# Altium schematic sheet LAN8720.SchDoc
size A
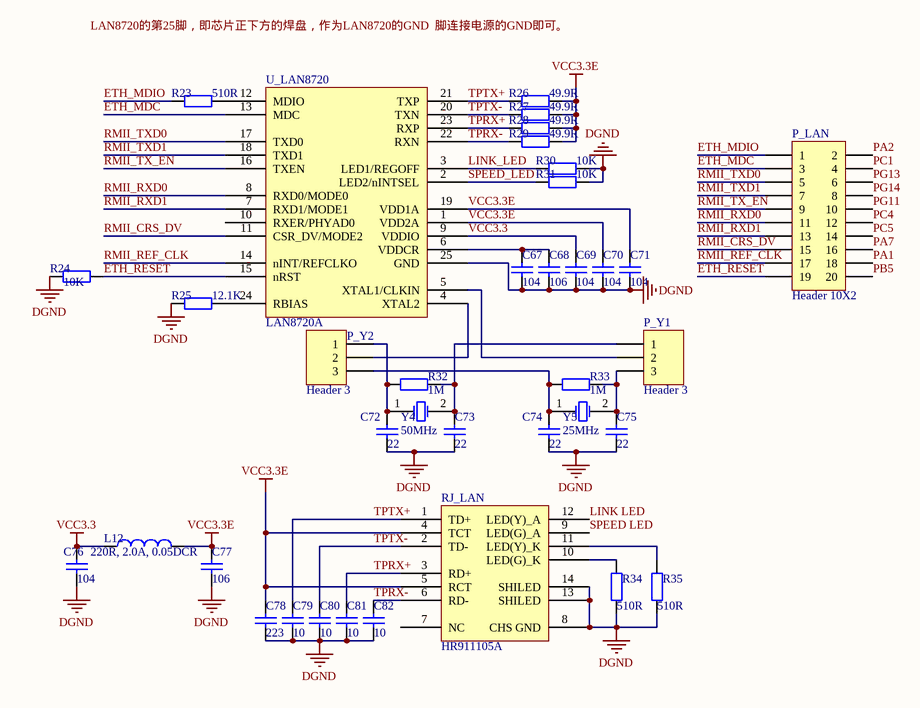
[diagram p0: LAN8720.SchDoc]

## Parts
C67  value 104  [SMT-0603]  (hidden comment: Cap)
C68  value 106  [SMT-0603]  (hidden comment: Cap)
C69  value 104  [SMT-0603]  (hidden comment: Cap)
C70  value 104  [SMT-0603]  (hidden comment: Cap)
C71  value 104  [SMT-0603]  (hidden comment: Cap)
C72  value 22  [SMT-0603]  (hidden comment: Cap)
C73  value 22  [SMT-0603]  (hidden comment: Cap)
C74  value 22  [SMT-0603]  (hidden comment: Cap)
C75  value 22  [SMT-0603]  (hidden comment: Cap)
C76  value 104  [SMT-0603]  (hidden comment: Cap)
C77  value 106  [SMT-0603]  (hidden comment: Cap)
C78  value 223  [SMT-0603]  (hidden comment: Cap)
C79  value 10  [SMT-0603]  (hidden comment: Cap)
C80  value 10  [SMT-0603]  (hidden comment: Cap)
C81  value 10  [SMT-0603]  (hidden comment: Cap)
C82  value 10  [SMT-0603]  (hidden comment: Cap)
L12  value 220R, 2.0A, 0.05DCR  [SMT-0603]  (hidden comment: Inductor)
P_LAN  Header 10X2  [HDR2X10]
P_Y1  Header 3  [HDR1X3]
P_Y2  Header 3  [HDR1X3]
R23  value 510R  [SMT-0603]  (hidden comment: Res2)
R24  value 10K  [SMT-0603]  (hidden comment: Res2)
R25  value 12.1K  [SMT-0603]  (hidden comment: Res2)
R26  value 49.9R  [SMT-0603]  (hidden comment: Res2)
R27  value 49.9R  [SMT-0603]  (hidden comment: Res2)
R28  value 49.9R  [SMT-0603]  (hidden comment: Res2)
R29  value 49.9R  [SMT-0603]  (hidden comment: Res2)
R30  value 10K  [SMT-0603]  (hidden comment: Res2)
R31  value 10K  [SMT-0603]  (hidden comment: Res2)
R32  value 1M  [SMT-0603]  (hidden comment: Res2)
R33  value 1M  [SMT-0603]  (hidden comment: Res2)
R34  value 510R  [SMT-0603]  (hidden comment: Res2)
R35  value 510R  [SMT-0603]  (hidden comment: Res2)
RJ_LAN  HR911105A  [RJ45-LED]
U_LAN8720  LAN8720A  [QFN24_0.5]
Y4  50MHz  [D-CRYSTAL3X8]
Y5  25MHz  [D-CRYSTAL3X8]

## Nets
DGND: C67.1 C68.1 C69.1 C70.1 C71.1 C72.1 C73.1 C74.1 C75.1 C76.1 C77.1 C78.1 C79.1 C80.1 C81.1 C82.1 R24.1 R25.1 R30.2 R31.2 R34.1 R35.1 RJ_LAN.8(CHS_GND) RJ_LAN.13(SHILED) RJ_LAN.14(SHILED) U_LAN8720.25(GND)
VCC3.3: C69.2 C76.2 L12.1 U_LAN8720.9(VDDIO)
VCC3.3E: C70.2 C71.2 C77.2 C78.2 L12.2 R26.2 R27.2 R28.2 R29.2 RJ_LAN.4(TCT) RJ_LAN.5(RCT) U_LAN8720.1(VDD2A) U_LAN8720.19(VDD1A)
ETH_MDC: P_LAN.3 U_LAN8720.13(MDC)
ETH_MDIO: P_LAN.1 R23.1
ETH_RESET: P_LAN.19 R24.2 U_LAN8720.15(nRST)
LINK LED: RJ_LAN.12(LED(Y)_A)
LINK_LED: R30.1 U_LAN8720.3(LED1/REGOFF)
PA1: P_LAN.18
PA2: P_LAN.2
PA7: P_LAN.16
PB5: P_LAN.20
PC1: P_LAN.4
PC4: P_LAN.12
PC5: P_LAN.14
PG11: P_LAN.10
PG13: P_LAN.6
PG14: P_LAN.8
RMII_CRS_DV: P_LAN.15 U_LAN8720.11(CSR_DV/MODE2)
RMII_REF_CLK: P_LAN.17 U_LAN8720.14(nINT/REFCLKO)
RMII_RXD0: P_LAN.11 U_LAN8720.8(RXD0/MODE0)
RMII_RXD1: P_LAN.13 U_LAN8720.7(RXD1/MODE1)
RMII_TX_EN: P_LAN.9 U_LAN8720.16(TXEN)
RMII_TXD0: P_LAN.5 U_LAN8720.17(TXD0)
RMII_TXD1: P_LAN.7 U_LAN8720.18(TXD1)
SPEED LED: RJ_LAN.9(LED(G)_A)
SPEED_LED: R31.1 U_LAN8720.2(LED2/nINTSEL)
TPRX+: C81.2 R28.1 RJ_LAN.3(RD+) U_LAN8720.23(RXP)
TPRX-: C82.2 R29.1 RJ_LAN.6(RD-) U_LAN8720.22(RXN)
TPTX+: C79.2 R26.1 RJ_LAN.1(TD+) U_LAN8720.21(TXP)
TPTX-: C80.2 R27.1 RJ_LAN.2(TD-) U_LAN8720.20(TXN)
NetC67_2: C67.2 C68.2 U_LAN8720.6(VDDCR)
NetC72_2: C72.2 P_Y2.1 R32.1 Y4.1(OSC1)
NetC73_2: C73.2 P_Y1.1 R32.2 Y4.2(OSC2)
NetC74_2: C74.2 P_Y2.3 R33.1 Y5.1(OSC1)
NetC75_2: C75.2 P_Y1.3 R33.2 Y5.2(OSC2)
NetP_Y1_2: P_Y1.2 U_LAN8720.5(XTAL1/CLKIN)
NetP_Y2_2: P_Y2.2 U_LAN8720.4(XTAL2)
NetR23_2: R23.2 U_LAN8720.12(MDIO)
NetR25_2: R25.2 U_LAN8720.24(RBIAS)
NetR34_2: R34.2 RJ_LAN.10(LED(G)_K)
NetR35_2: R35.2 RJ_LAN.11(LED(Y)_K)

Not connected (* = marked no-connect by the designer): RJ_LAN 7(NC); U_LAN8720 10(RXER/PHYAD0)

## Notes on the sheet
- Labels drawn without touching a wire or pin: LAN8720的第25脚，即芯片正下方的焊盘，作为LAN8720的GND  脚连接电源的GND即可。

## Library data of the parts
C67-C82 = Cap: Capacitor; Published: 8-Jun-2000; LatestRevisionDate: 17-Jul-2002; LatestRevisionNote: Re-released for DXP Platform.; PackageReference: RAD-0.3; Publisher: Altium Limited; PackageDescription: Radial Cap, Thru-Hole; 2 Leads; 0.3 in Pin Spacing
L12 = Inductor: Code_IEC: 1005; Published: 8-Jun-2000; LatestRevisionDate: 29-May-2009; LatestRevisionNote: IPC-7351 Footprint Added.; PackageReference: 0402-A; Publisher: Altium Limited; PackageDescription: Chip Inductor; Code_JEITA: 0402
P_LAN = Header 10X2: Header, 10-Pin, Dual row; LatestRevisionDate: 17-Jul-2002; LatestRevisionNote: Re-released for DXP Platform.; Publisher: Altium Limited
P_Y1 P_Y2 = Header 3: Header, 3-Pin; LatestRevisionDate: 17-Jul-2002; LatestRevisionNote: Re-released for DXP Platform.; Publisher: Altium Limited
R23-R35 = Res2: Resistor; Published: 8-Jun-2000; LatestRevisionDate: 17-Jul-2002; LatestRevisionNote: Re-released for DXP Platform.; PackageReference: AXIAL-0.4; Publisher: Altium Limited; PackageDescription: Axial Device, Thru-Hole; 2 Leads; 0.4 in Pin Spacing
RJ_LAN = RJ45
Y4 Y5 = XTAL: Crystal Oscillator; Published: 8-Jun-2000; LatestRevisionDate: 17-Jul-2002; LatestRevisionNote: Re-released for DXP Platform.; PackageReference: R38; Publisher: Altium Limited; PackageDescription: Crystal, Thru-Hole; 2 Leads; Body 3.1 x 8.2 mm (Dia.xH)